# EAGLE schematic FQP30N06L H Bridge (EAGLE 6.5.0)
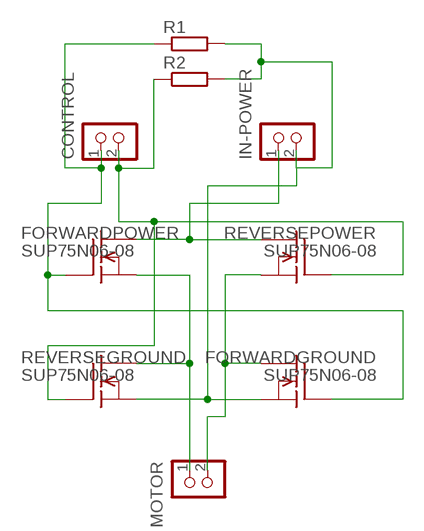
[diagram p0: schematic, sheet 1]

## Parts
CONTROL  CON_HEADER_1X02-PTH  [M1X2]
FORWARDGROUND  SUP75N06-08  [TO220]
FORWARDPOWER  SUP75N06-08  [TO220]
IN-POWER  CON_HEADER_1X02-PTH  [M1X2]
MOTOR  CON_HEADER_1X02-PTH  [M1X2]
R1  RESISTOR-PTH-0.4  [RTH025W]
R2  RESISTOR-PTH-0.4  [RTH025W]
REVERSEGROUND  SUP75N06-08  [TO220]
REVERSEPOWER  SUP75N06-08  [TO220]

## Nets
N$1: CONTROL.2 R2.1 REVERSEGROUND.1(G) REVERSEPOWER.1(G)
N$2: CONTROL.1 FORWARDGROUND.1(G) FORWARDPOWER.1(G) R1.1
N$3: FORWARDGROUND.3(S) IN-POWER.2 R1.2 R2.2 REVERSEGROUND.3(S)
N$4: FORWARDPOWER.2(D) IN-POWER.1 REVERSEPOWER.2(D)
N$5: FORWARDPOWER.3(S) MOTOR.1 REVERSEGROUND.2(D)
N$7: FORWARDGROUND.2(D) MOTOR.2 REVERSEPOWER.3(S)

## Library data of the parts
CONTROL IN-POWER MOTOR = dp_devices:CON_HEADER_1X02
FORWARDGROUND FORWARDPOWER REVERSEGROUND REVERSEPOWER = transistor-fet:SUP75N06-08: N-Channel Enhancement MOSFET 60V; 75A; 0,008Ohm
R1 R2 = dp_devices:RESISTOR

## Net classes
0 default: width 0.635 mm